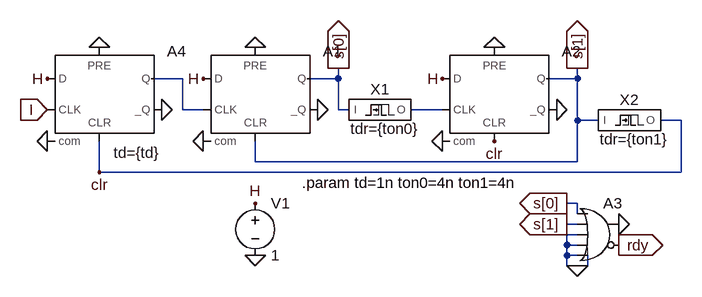
[diagram p0: schematic sm_seq_timer_2state.asc]
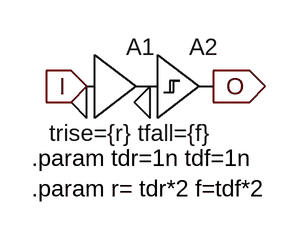
[diagram p1: sub-circuit delay.asc]
sm_seq_timer_2state.asc, the LTspice schematic file:
Version 4
SHEET 1 880 712
WIRE -1152 112 -1200 112
WIRE -912 112 -912 96
WIRE -912 112 -960 112
WIRE -544 112 -544 96
WIRE -544 112 -592 112
WIRE -1152 160 -1152 112
WIRE -1120 160 -1152 160
WIRE -912 160 -912 112
WIRE -896 160 -912 160
WIRE -752 160 -800 160
WIRE -544 176 -544 112
WIRE -512 176 -544 176
WIRE -384 176 -416 176
WIRE -1040 240 -1040 208
WIRE -544 240 -544 176
WIRE -544 240 -1040 240
WIRE -1280 256 -1280 208
WIRE -384 256 -384 176
WIRE -384 256 -1280 256
WIRE -544 304 -560 304
WIRE -544 320 -544 304
WIRE -544 336 -560 336
WIRE -544 352 -560 352
WIRE -560 368 -560 352
WIRE -544 368 -560 368
WIRE -560 384 -560 368
WIRE -544 384 -560 384
WIRE -560 400 -560 384
WIRE -544 400 -560 400
WIRE -528 400 -528 384
WIRE -528 400 -544 400
FLAG -1120 208 0
FLAG -752 208 0
FLAG -1040 64 0
FLAG -1360 160 I
IOPIN -1360 160 In
FLAG -672 64 0
FLAG -544 96 s[1]
IOPIN -544 96 Out
FLAG -944 160 0
FLAG -576 160 0
FLAG -1040 384 0
FLAG -1040 304 H
FLAG -1120 112 H
FLAG -752 112 H
FLAG -912 96 s[0]
IOPIN -912 96 Out
FLAG -544 400 0
FLAG -480 336 0
FLAG -560 304 s[0]
IOPIN -560 304 Out
FLAG -560 336 s[1]
IOPIN -560 336 Out
FLAG -480 368 rdy
IOPIN -480 368 Out
FLAG -1360 208 0
FLAG -1280 64 0
FLAG -1184 160 0
FLAG -1360 112 H
FLAG -1280 256 clr
FLAG -672 208 clr
SYMBOL voltage -1040 288 R0
SYMATTR InstName V1
SYMATTR Value 1
SYMBOL Digital\\dflop -1040 64 R0
WINDOW 3 0 0 Invisible 0
SYMATTR Value td=0.5n
SYMATTR InstName A1
SYMBOL Digital\\dflop -672 64 R0
WINDOW 3 0 0 Invisible 0
SYMATTR Value td=0.5n
SYMATTR InstName A2
SYMBOL Digital\\or -512 288 R0
SYMATTR InstName A3
SYMBOL Digital\\dflop -1280 64 R0
WINDOW 3 22 162 Left 2
SYMATTR Value td={td}
SYMATTR InstName A4
SYMBOL delay -848 160 R0
WINDOW 39 8 45 Bottom 2
SYMATTR SpiceLine tdr={ton0}
SYMATTR InstName X1
SYMBOL delay -464 176 R0
WINDOW 39 8 45 Bottom 2
SYMATTR SpiceLine tdr={ton1}
SYMATTR InstName X2
TEXT -968 272 Left 2 !.param td=1n ton0=4n ton1=4n

delay.asc, the sub-circuit schematic file:
Version 4
SHEET 1 880 680
FLAG 144 176 0
FLAG 208 176 0
FLAG 272 160 O
IOPIN 272 160 Out
FLAG 144 160 I
IOPIN 144 160 In
SYMBOL Digital\\buf1 144 96 R0
WINDOW 3 -38 111 Left 2
SYMATTR Value trise={r} tfall={f}
SYMATTR InstName A1
SYMBOL Digital\\schmtbuf 208 96 R0
SYMATTR InstName A2
TEXT 88 232 Left 2 !.param tdr=1n tdf=1n\n.param r= tdr*2 f=tdf*2

The netlist it stands for:
* sm_seq_timer_2state.asc
V1 H 0 1
A1 H 0 N001 0 s[1] 0 s[0] 0 DFLOP td=0.5n
A2 H 0 N002 0 clr 0 s[1] 0 DFLOP td=0.5n
A3 s[0] s[1] 0 0 0 rdy 0 0 OR
A4 H 0 I 0 clr 0 N001 0 DFLOP td={td}
XX1 s[0] N002 delay params: tdr={ton0}
XX2 s[1] clr delay params: tdr={ton1}

* block symbol definitions
.subckt delay I O
A1 I 0 0 0 0 0 P001 0 BUF trise={r} tfall={f}
A2 P001 0 0 0 0 0 O 0 SCHMITT
.param tdr=1n tdf=1n
.param r= tdr*2 f=tdf*2
.ends delay

.param td=1n ton0=4n ton1=4n
.backanno
.end